# Altium project NG2092_R0M0E0.PrjPcb (part 1 of 8)
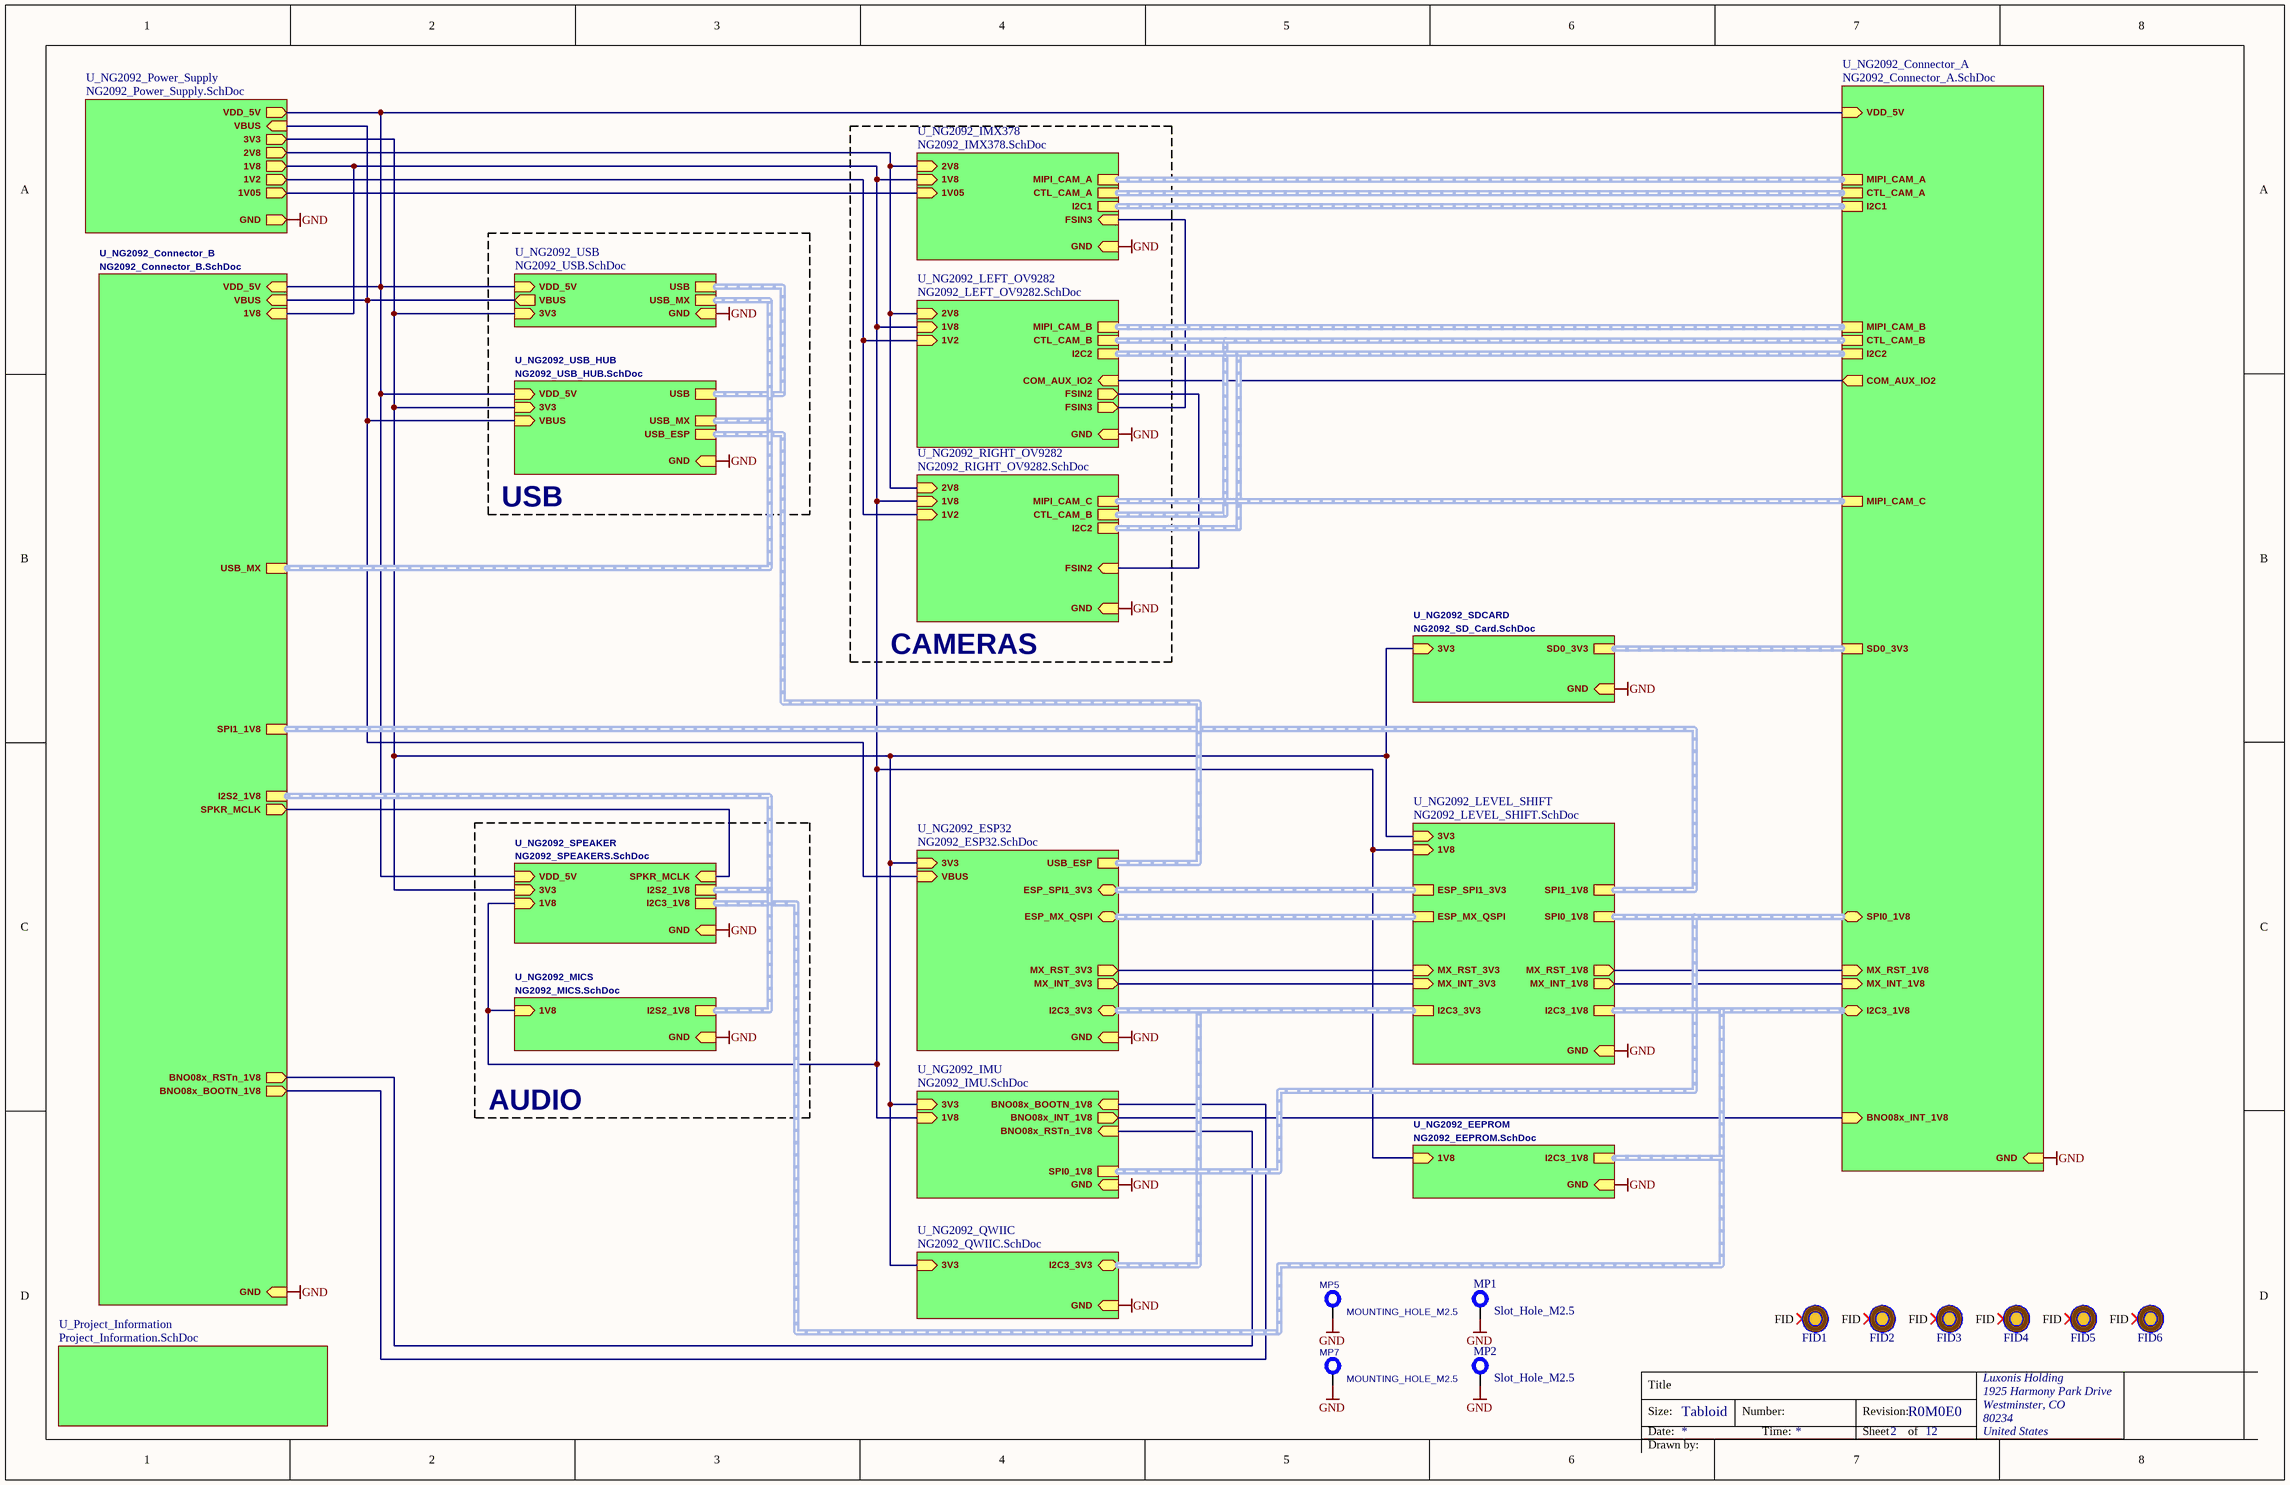
[diagram p0: NG2092_TopLevel.SchDoc]
document_number: DXXXX; drawn_by: Nejc Gostincar; project_title: NG2092; revision: R0M0E0
18 sheets, 265 parts. Net scope: strictly hierarchical (ports join the sheet entries above them; power ports are local).
Board file: NG2092.PcbDoc
Sheets:
  NG2092_TopLevel.SchDoc
    U_NG2092_Power_Supply = NG2092_Power_Supply.SchDoc
    U_NG2092_Connector_A = NG2092_Connector_A.SchDoc
    U_NG2092_IMX378 = NG2092_IMX378.SchDoc
    U_NG2092_RIGHT_OV9282 = NG2092_RIGHT_OV9282.SchDoc
    U_NG2092_LEFT_OV9282 = NG2092_LEFT_OV9282.SchDoc
    U_NG2092_USB = NG2092_USB.SchDoc
    U_Project_Information = Project_Information.SchDoc
    U_NG2092_ESP32 = NG2092_ESP32.SchDoc
    U_NG2092_IMU = NG2092_IMU.SchDoc
    U_NG2092_QWIIC = NG2092_QWIIC.SchDoc
    U_NG2092_LEVEL_SHIFT = NG2092_LEVEL_SHIFT.SchDoc
    U_NG2092_Connector_B = NG2092_Connector_B.SchDoc
    U_NG2092_MICS = NG2092_MICS.SchDoc
    U_NG2092_USB_HUB = NG2092_USB_HUB.SchDoc
    U_NG2092_SDCARD = NG2092_SD_Card.SchDoc
    U_NG2092_SPEAKER = NG2092_SPEAKERS.SchDoc
    U_NG2092_EEPROM = NG2092_EEPROM.SchDoc

## Sheet NG2092_TopLevel.SchDoc: =project_title
size Tabloid; CompanyName: Luxonis Holding; DrawnBy: Nejc Gostincar; Organization: Luxonis Holding; Address1: 1925 Harmony Park Drive; Address2: Westminster, CO; Address3: 80234; Address4: United States; DocumentNumber: DXXXX; Revision: R0M0E0; SheetNumber: 2; SheetTotal: 12

### Parts
FID1  FIDUCIAL_ROUND_1MM  [FIDUCIAL_ROUND_1MM]  (value not drawn)  (no BOM)
FID2  FIDUCIAL_ROUND_1MM  [FIDUCIAL_ROUND_1MM]  (value not drawn)  (no BOM)
FID3  FIDUCIAL_ROUND_1MM  [FIDUCIAL_ROUND_1MM]  (value not drawn)  (no BOM)
FID4  FIDUCIAL_ROUND_1MM  [FIDUCIAL_ROUND_1MM]  (value not drawn)  (no BOM)
FID5  FIDUCIAL_ROUND_1MM  [FIDUCIAL_ROUND_1MM]  (value not drawn)  (no BOM)
FID6  FIDUCIAL_ROUND_1MM  [FIDUCIAL_ROUND_1MM]  (value not drawn)  (no BOM)
MP1  Slot_Hole_M2.5  [Slot_Hole_M2.5]  (no BOM)
MP2  Slot_Hole_M2.5  [Slot_Hole_M2.5]  (no BOM)
MP5  MOUNTING_HOLE_M2.5  [MOUNTING_HOLE_M2.5]  (no BOM)
MP7  MOUNTING_HOLE_M2.5  [MOUNTING_HOLE_M2.5]  (no BOM)

### Sub-sheets
U_NG2092_Connector_A = NG2092_Connector_A.SchDoc: MIPI_CAM_B (harness MIPI_CAM_B), MIPI_CAM_A (harness MIPI_CAM_A), MIPI_CAM_C (harness MIPI_CAM_C), I2C2 (harness I2C2), I2C1 (harness I2C1), CTL_CAM_A (harness CTL_CAM_A), CTL_CAM_B (harness CTL_CAM_B), VDD_5V (in), GND (in), COM_AUX_IO2 (out), BNO08x_INT_1V8 (in), SPI0_1V8 (bidir, harness SP0_1V8), I2C3_1V8 (bidir, harness I2C3_1V8), MX_INT_1V8 (in), MX_RST_1V8 (in), SD0_3V3 (harness SD0_3V3)
U_NG2092_Connector_B = NG2092_Connector_B.SchDoc: VDD_5V (in), I2S2_1V8 (harness I2S2_1V8), GND (in), VBUS (in), SPI1_1V8 (harness SPI1_1V8), SPKR_MCLK (out), BNO08x_RSTn_1V8 (out), BNO08x_BOOTN_1V8 (out), USB_MX (harness USB_MX), 1V8 (in)
U_NG2092_EEPROM = NG2092_EEPROM.SchDoc: I2C3_1V8 (harness I2C3_1V8), 1V8 (in), GND (in)
U_NG2092_ESP32 = NG2092_ESP32.SchDoc: GND (in), 3V3 (in), MX_RST_3V3 (out), MX_INT_3V3 (out), I2C3_3V3 (bidir, harness I2C3_3V3), ESP_SPI1_3V3 (bidir, harness ESP_SPI1_3V3), ESP_MX_QSPI (bidir, harness ESP_MX_QSPI_3V3), USB_ESP (harness USB_ESP), VBUS (in)
U_NG2092_IMU = NG2092_IMU.SchDoc: BNO08x_BOOTN_1V8 (in), GND (in), 3V3 (in), BNO08x_INT_1V8 (out), BNO08x_RSTn_1V8 (in), SPI0_1V8 (harness SPI0_1V8), 1V8 (in)
U_NG2092_IMX378 = NG2092_IMX378.SchDoc: 2V8 (in), 1V05 (in), I2C1 (harness I2C1), MIPI_CAM_A (harness MIPI_CAM_A), CTL_CAM_A (harness CTL_CAM_A), GND (in), 1V8 (in), FSIN3 (in)
U_NG2092_LEFT_OV9282 = NG2092_LEFT_OV9282.SchDoc: I2C2 (harness I2C2), CTL_CAM_B (harness CTL_CAM_B), MIPI_CAM_B (harness MIPI_CAM_B), 1V2 (in), 2V8 (in), GND (in), 1V8 (in), FSIN2 (out), COM_AUX_IO2 (in), FSIN3 (out)
U_NG2092_LEVEL_SHIFT = NG2092_LEVEL_SHIFT.SchDoc: GND (in), 3V3 (in), 1V8 (in), I2C3_3V3 (harness I2C3_3V3), I2C3_1V8 (harness I2C3_1V8), MX_INT_3V3 (in), MX_INT_1V8 (out), MX_RST_1V8 (out), MX_RST_3V3 (in), SPI0_1V8 (harness SPI0_1V8), ESP_MX_QSPI (harness ESP_MX_QSPI_3V3), ESP_SPI1_3V3 (harness ESP_SPI1_3V3), SPI1_1V8 (harness SPI1_1V8)
U_NG2092_MICS = NG2092_MICS.SchDoc: I2S2_1V8 (harness I2S2_1V8), 1V8 (in), GND (in)
U_NG2092_Power_Supply = NG2092_Power_Supply.SchDoc: 1V2 (out), 2V8 (out), GND (out), 1V8 (out), VDD_5V (out), VBUS (in), 3V3 (out), 1V05 (out)
U_NG2092_QWIIC = NG2092_QWIIC.SchDoc: GND (in), 3V3 (in), I2C3_3V3 (bidir, harness I2C3_3V3)
U_NG2092_RIGHT_OV9282 = NG2092_RIGHT_OV9282.SchDoc: MIPI_CAM_C (harness MIPI_CAM_C), I2C2 (harness I2C2), 1V2 (in), 2V8 (in), GND (in), 1V8 (in), FSIN2 (in), CTL_CAM_B (harness CTL_CAM_B)
U_NG2092_SDCARD = NG2092_SD_Card.SchDoc: GND (in), 3V3 (in), SD0_3V3 (harness SD0_3V3)
U_NG2092_SPEAKER = NG2092_SPEAKERS.SchDoc: SPKR_MCLK (in), 3V3 (in), VDD_5V (in), GND (in), I2C3_1V8 (harness I2C3_1V8), I2S2_1V8 (harness I2S2_1V8), 1V8 (in)
U_NG2092_USB = NG2092_USB.SchDoc: USB (harness USB), VBUS (out), GND (in), 3V3 (in), VDD_5V (in), USB_MX (harness USB_MX)
U_NG2092_USB_HUB = NG2092_USB_HUB.SchDoc: USB_MX (harness USB_MX), USB (harness USB), USB_ESP (harness USB_ESP), VDD_5V (in), 3V3 (in), GND (in), VBUS (in)
U_Project_Information = Project_Information.SchDoc: no entries

### Nets
1V2: sheet U_NG2092_Power_Supply/1V2, sheet U_NG2092_RIGHT_OV9282/1V2, sheet U_NG2092_LEFT_OV9282/1V2
1V05: sheet U_NG2092_Power_Supply/1V05, sheet U_NG2092_IMX378/1V05
1V8: sheet U_NG2092_Power_Supply/1V8, sheet U_NG2092_IMX378/1V8, sheet U_NG2092_RIGHT_OV9282/1V8, sheet U_NG2092_LEFT_OV9282/1V8, sheet U_NG2092_IMU/1V8, sheet U_NG2092_LEVEL_SHIFT/1V8, sheet U_NG2092_Connector_B/1V8, sheet U_NG2092_MICS/1V8, sheet U_NG2092_SPEAKER/1V8, sheet U_NG2092_EEPROM/1V8
2V8: sheet U_NG2092_Power_Supply/2V8, sheet U_NG2092_IMX378/2V8, sheet U_NG2092_RIGHT_OV9282/2V8, sheet U_NG2092_LEFT_OV9282/2V8
3V3: sheet U_NG2092_Power_Supply/3V3, sheet U_NG2092_USB/3V3, sheet U_NG2092_ESP32/3V3, sheet U_NG2092_IMU/3V3, sheet U_NG2092_QWIIC/3V3, sheet U_NG2092_LEVEL_SHIFT/3V3, sheet U_NG2092_USB_HUB/3V3, sheet U_NG2092_SDCARD/3V3, sheet U_NG2092_SPEAKER/3V3
GND: MP1.1 MP2.1 MP5.1 MP7.1 ; sheet U_NG2092_Power_Supply/GND, sheet U_NG2092_Connector_A/GND, sheet U_NG2092_IMX378/GND, sheet U_NG2092_RIGHT_OV9282/GND, sheet U_NG2092_LEFT_OV9282/GND, sheet U_NG2092_USB/GND, sheet U_NG2092_ESP32/GND, sheet U_NG2092_IMU/GND, sheet U_NG2092_QWIIC/GND, sheet U_NG2092_LEVEL_SHIFT/GND, sheet U_NG2092_Connector_B/GND, sheet U_NG2092_MICS/GND, sheet U_NG2092_USB_HUB/GND, sheet U_NG2092_SDCARD/GND, sheet U_NG2092_SPEAKER/GND, sheet U_NG2092_EEPROM/GND
VBUS: sheet U_NG2092_Power_Supply/VBUS, sheet U_NG2092_USB/VBUS, sheet U_NG2092_ESP32/VBUS, sheet U_NG2092_Connector_B/VBUS, sheet U_NG2092_USB_HUB/VBUS
VDD_5V: sheet U_NG2092_Power_Supply/VDD_5V, sheet U_NG2092_Connector_A/VDD_5V, sheet U_NG2092_USB/VDD_5V, sheet U_NG2092_Connector_B/VDD_5V, sheet U_NG2092_USB_HUB/VDD_5V, sheet U_NG2092_SPEAKER/VDD_5V
BNO08x_BOOTN_1V8: sheet U_NG2092_IMU/BNO08x_BOOTN_1V8, sheet U_NG2092_Connector_B/BNO08x_BOOTN_1V8
BNO08x_INT_1V8: sheet U_NG2092_Connector_A/BNO08x_INT_1V8, sheet U_NG2092_IMU/BNO08x_INT_1V8
BNO08x_RSTn_1V8: sheet U_NG2092_IMU/BNO08x_RSTn_1V8, sheet U_NG2092_Connector_B/BNO08x_RSTn_1V8
COM_AUX_IO2: sheet U_NG2092_Connector_A/COM_AUX_IO2, sheet U_NG2092_LEFT_OV9282/COM_AUX_IO2
FSIN2: sheet U_NG2092_RIGHT_OV9282/FSIN2, sheet U_NG2092_LEFT_OV9282/FSIN2
FSIN3: sheet U_NG2092_IMX378/FSIN3, sheet U_NG2092_LEFT_OV9282/FSIN3
MX_INT_1V8: sheet U_NG2092_Connector_A/MX_INT_1V8, sheet U_NG2092_LEVEL_SHIFT/MX_INT_1V8
MX_INT_3V3: sheet U_NG2092_ESP32/MX_INT_3V3, sheet U_NG2092_LEVEL_SHIFT/MX_INT_3V3
MX_RST_1V8: sheet U_NG2092_Connector_A/MX_RST_1V8, sheet U_NG2092_LEVEL_SHIFT/MX_RST_1V8
MX_RST_3V3: sheet U_NG2092_ESP32/MX_RST_3V3, sheet U_NG2092_LEVEL_SHIFT/MX_RST_3V3
SPKR_MCLK: sheet U_NG2092_Connector_B/SPKR_MCLK, sheet U_NG2092_SPEAKER/SPKR_MCLK

Not connected (* = marked no-connect by the designer): FID1 FID*; FID2 FID*; FID3 FID*; FID4 FID*; FID5 FID*; FID6 FID*

### Buses and harness runs
harness sheet U_NG2092_Connector_A/CTL_CAM_A = sheet U_NG2092_IMX378/CTL_CAM_A
harness sheet U_NG2092_Connector_A/CTL_CAM_B = sheet U_NG2092_LEFT_OV9282/CTL_CAM_B = sheet U_NG2092_RIGHT_OV9282/CTL_CAM_B
harness sheet U_NG2092_Connector_A/I2C1 = sheet U_NG2092_IMX378/I2C1
harness sheet U_NG2092_Connector_A/I2C2 = sheet U_NG2092_LEFT_OV9282/I2C2 = sheet U_NG2092_RIGHT_OV9282/I2C2
harness sheet U_NG2092_Connector_A/I2C3_1V8 = sheet U_NG2092_EEPROM/I2C3_1V8 = sheet U_NG2092_LEVEL_SHIFT/I2C3_1V8 = sheet U_NG2092_SPEAKER/I2C3_1V8
harness sheet U_NG2092_Connector_A/MIPI_CAM_A = sheet U_NG2092_IMX378/MIPI_CAM_A
harness sheet U_NG2092_Connector_A/MIPI_CAM_B = sheet U_NG2092_LEFT_OV9282/MIPI_CAM_B
harness sheet U_NG2092_Connector_A/MIPI_CAM_C = sheet U_NG2092_RIGHT_OV9282/MIPI_CAM_C
harness sheet U_NG2092_Connector_A/SD0_3V3 = sheet U_NG2092_SDCARD/SD0_3V3
harness sheet U_NG2092_Connector_A/SPI0_1V8 = sheet U_NG2092_IMU/SPI0_1V8 = sheet U_NG2092_LEVEL_SHIFT/SPI0_1V8
harness sheet U_NG2092_Connector_B/I2S2_1V8 = sheet U_NG2092_MICS/I2S2_1V8 = sheet U_NG2092_SPEAKER/I2S2_1V8
harness sheet U_NG2092_Connector_B/SPI1_1V8 = sheet U_NG2092_LEVEL_SHIFT/SPI1_1V8
harness sheet U_NG2092_Connector_B/USB_MX = sheet U_NG2092_USB/USB_MX = sheet U_NG2092_USB_HUB/USB_MX
harness sheet U_NG2092_ESP32/ESP_MX_QSPI = sheet U_NG2092_LEVEL_SHIFT/ESP_MX_QSPI
harness sheet U_NG2092_ESP32/ESP_SPI1_3V3 = sheet U_NG2092_LEVEL_SHIFT/ESP_SPI1_3V3
harness sheet U_NG2092_ESP32/I2C3_3V3 = sheet U_NG2092_LEVEL_SHIFT/I2C3_3V3 = sheet U_NG2092_QWIIC/I2C3_3V3
harness sheet U_NG2092_ESP32/USB_ESP = sheet U_NG2092_USB_HUB/USB_ESP
harness sheet U_NG2092_USB/USB = sheet U_NG2092_USB_HUB/USB

### Notes on the sheet
- USB
- CAMERAS
- AUDIO
- Title
- Size:
- Date:
- Tabloid
- Number:
- Time:
- Revision:
- Sheet
- of
- Drawn by:

### Library data of the parts
FID1-FID6 = FIDUCIAL: Fiducial with various available footprints
MP1 MP2 = MP_Slot-Holes: =CurrentFootprint; B - Value: Not a Part; A - Level: 0
MP5 MP7 = MP_Mounting-Holes: =CurrentFootprint; B - Value: Not a Part; A - Level: 0

## Sheet NG2092_Power_Supply.SchDoc: =project_title
size Tabloid; PageSetup: Record=PageOptions|CenterHorizontal=True|CenterVertical=True|PrintScale=0.73|XCorrection=1.00|YCorrection=1.00|PrintKind=0|BorderSize=5000000|LeftOffset=0|BottomOffset=0|Orientation=2|PaperLength=1000|PaperWidth=1000|Scale=100|PaperSource=7|PrintQuality=-4|MediaType=1|DitherType=10|PaperKind=A4|PrintScaleMode=1; CompanyName: Luxonis Holding; DrawnBy: Nejc Gostincar; Organization: Luxonis Holding; Address1: 1925 Harmony Park Drive; Address2: Westminster, CO; Address3: 80234; Address4: United States; DocumentNumber: DXXXX; Revision: R0M0E0; SheetNumber: 6; SheetTotal: 12
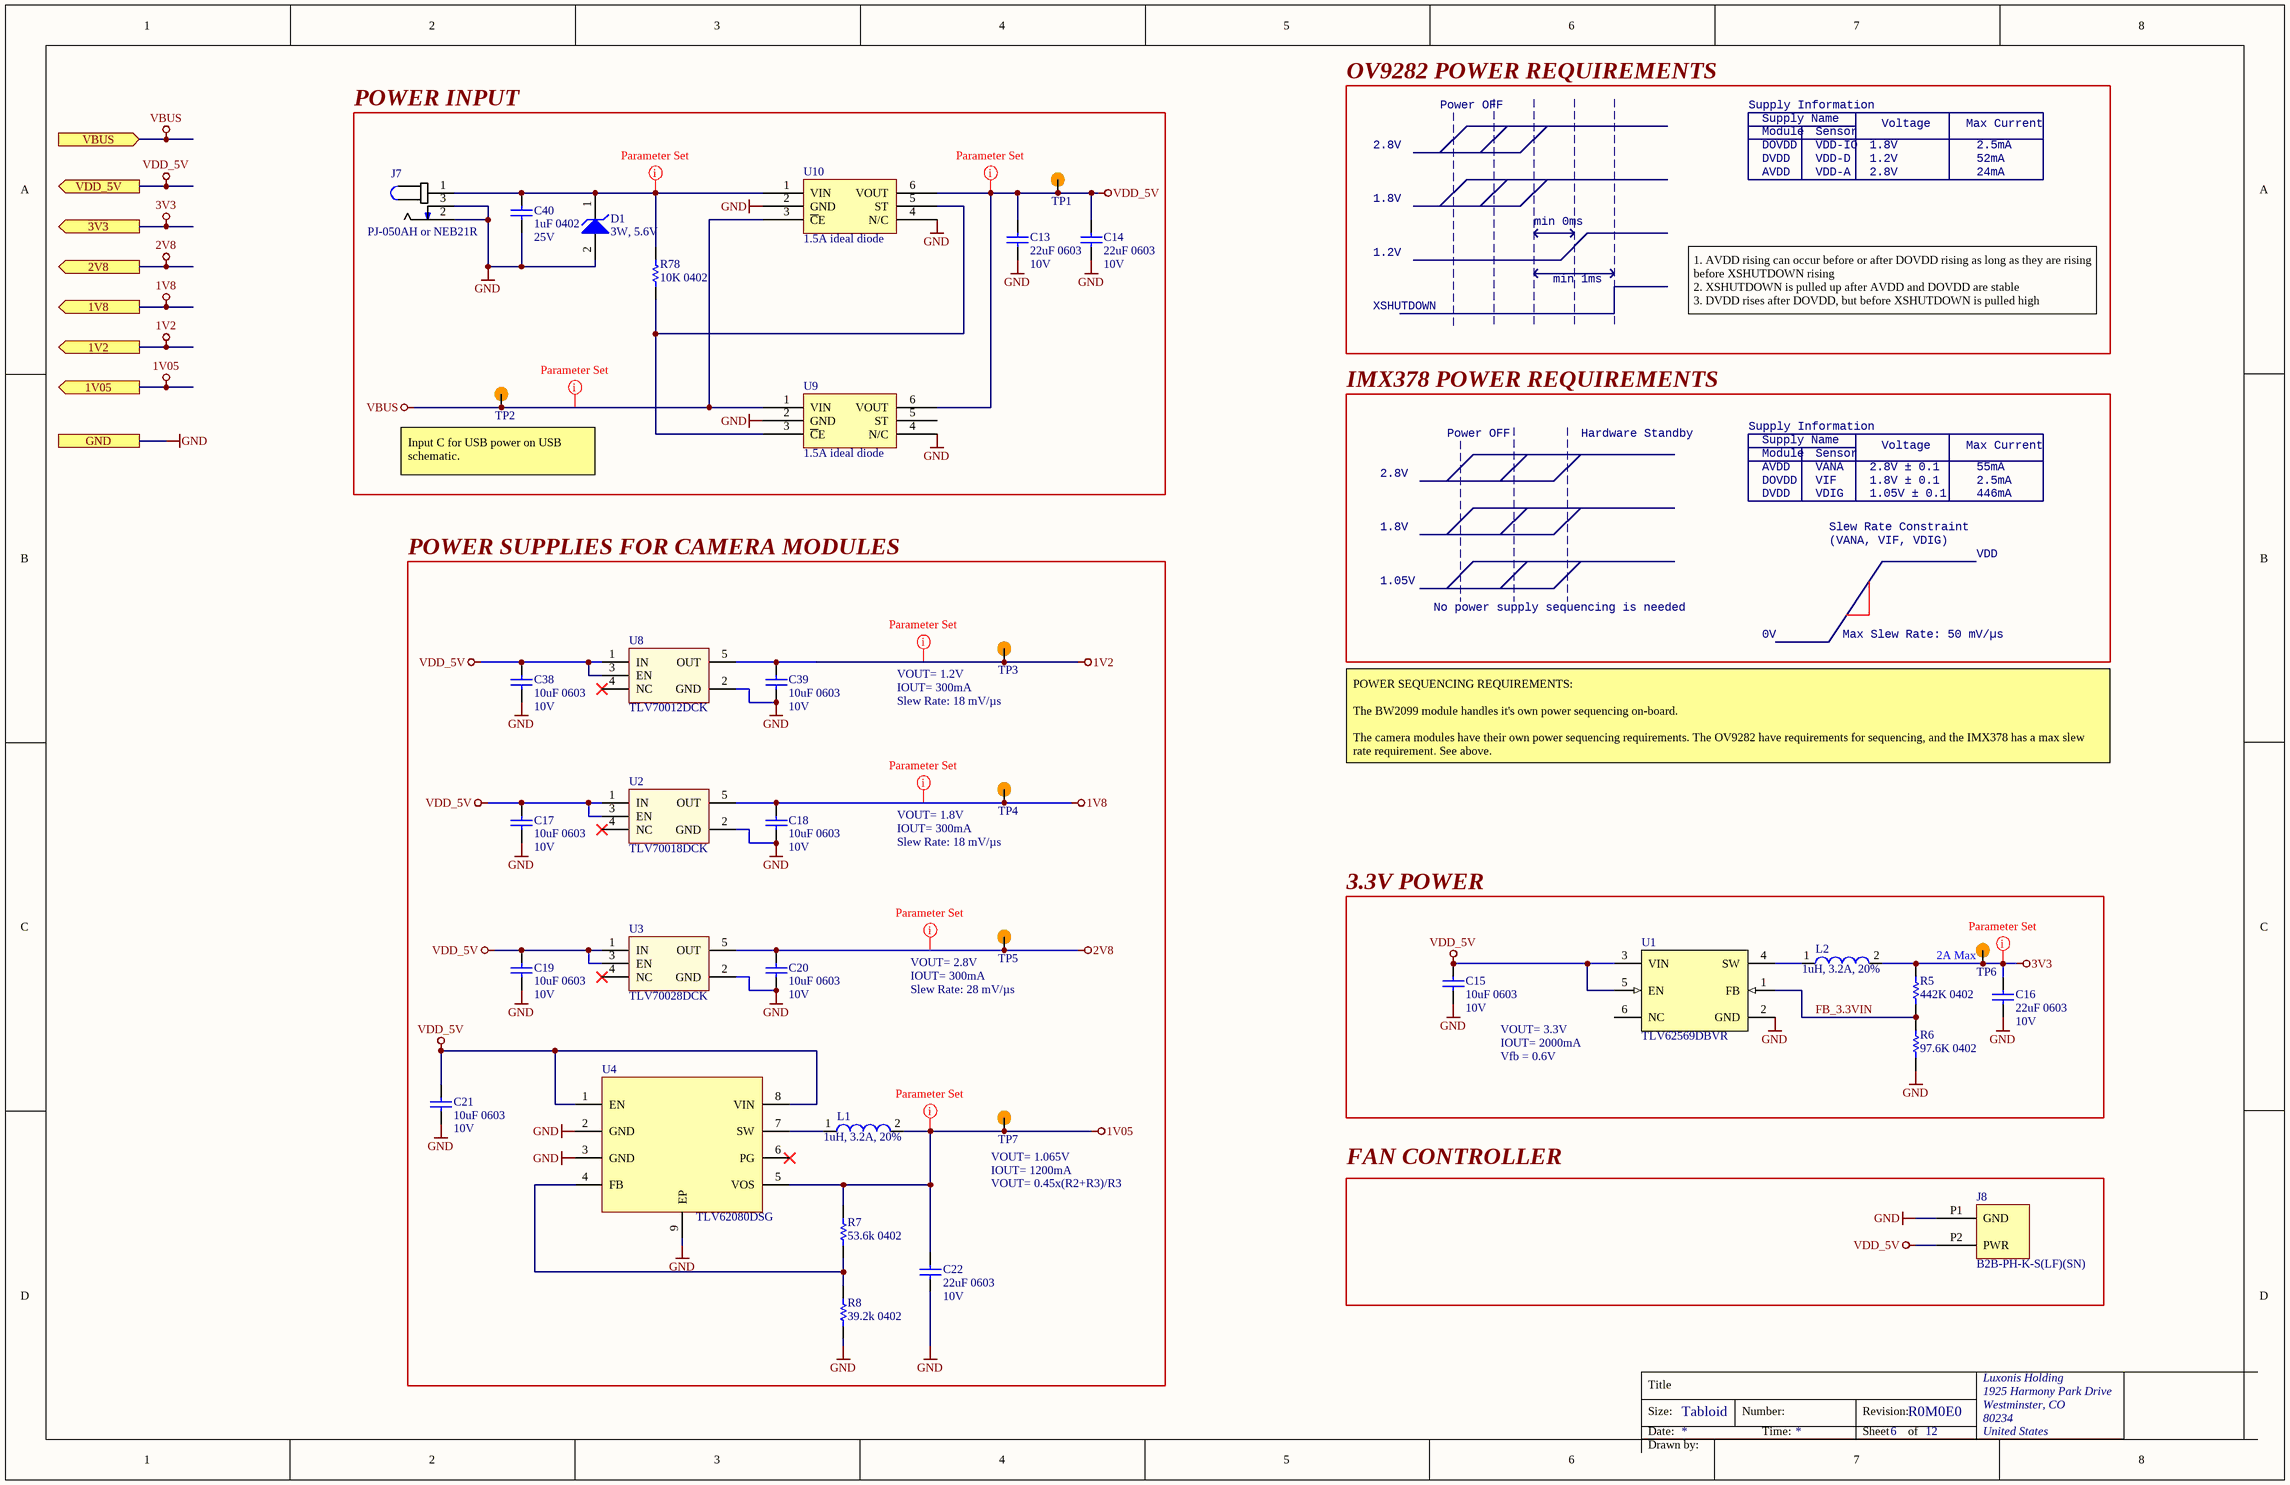
[diagram p1: NG2092_Power_Supply.SchDoc]

### Parts
C13  22uF 0603  Voltage Rating: 10V  [CAPC0603(1608)100_L]
C14  22uF 0603  Voltage Rating: 10V  [CAPC0603(1608)100_L]
C15  10uF 0603  Voltage Rating: 10V  [CAPC0603(1608)100_L]
C16  22uF 0603  Voltage Rating: 10V  [CAPC0603(1608)100_L]
C17  10uF 0603  Voltage Rating: 10V  [CAPC0603(1608)100_L]
C18  10uF 0603  Voltage Rating: 10V  [CAPC0603(1608)100_L]
C19  10uF 0603  Voltage Rating: 10V  [CAPC0603(1608)100_L]
C20  10uF 0603  Voltage Rating: 10V  [CAPC0603(1608)100_L]
C21  10uF 0603  Voltage Rating: 10V  [CAPC0603(1608)100_L]
C22  22uF 0603  Voltage Rating: 10V  [CAPC0603(1608)100_L]
C38  10uF 0603  Voltage Rating: 10V  [CAPC0603(1608)100_L]
C39  10uF 0603  Voltage Rating: 10V  [CAPC0603(1608)100_L]
C40  1uF 0402  Voltage Rating: 25V  [CAPC0402(1005)70_N]
D1  3W, 5.6V  [1SMB5919BT3G]
J7  PJ-050AH or NEB21R  [PJ-050AH/NEB21R_COMBO]
J8  B2B-PH-K-S(LF)(SN)  [B2B-PH-K-S(LF)(SN)]
L1  1uH, 3.2A, 20%  [DFE252012P-1R0M=P2]
L2  1uH, 3.2A, 20%  [DFE252012P-1R0M=P2]
R5  442K 0402  [RESC0402(1005)_N]
R6  97.6K 0402  [RESC0402(1005)_N]
R7  53.6k 0402  [RESC0402(1005)_L]
R8  39.2k 0402  [RESC0402(1005)_L]
R78  10K 0402  [RESC0402(1005)_N]
TP1  TP075_150_NS  [TP075_150_NS]  (value not drawn)  (no BOM)
TP2  TP075_150_NS  [TP075_150_NS]  (value not drawn)  (no BOM)
TP3  TP075_150_NS  [TP075_150_NS]  (value not drawn)  (no BOM)
TP4  TP075_150_NS  [TP075_150_NS]  (value not drawn)  (no BOM)
TP5  TP075_150_NS  [TP075_150_NS]  (value not drawn)  (no BOM)
TP6  TP075_150_NS  [TP075_150_NS]  (value not drawn)  (no BOM)
TP7  TP075_150_NS  [TP075_150_NS]  (value not drawn)  (no BOM)
U1  TLV62569DBVR  [SOT95P270X130-6N]
U2  TLV70018DCK  [TLV70018DCK]
U3  TLV70028DCK  [TLV70028DCK]
U4  TLV62080DSG  [TLV62080DSG]
U8  TLV70012DCK  [TLV70012DCK]
U9  1.5A ideal diode  [LM66100DCKR]
U10  1.5A ideal diode  [LM66100DCKR]

### Blocks framed on the sheet
POWER INPUT: C13 C14 C40 D1 J7 R78 TP1 TP2 U9 U10
POWER SUPPLIES FOR CAMERA MODULES: C17-C22 C38 C39 L1 R7 R8 TP3-TP5 TP7 U2-U4 U8
3.3V POWER: C15 C16 L2 R5 R6 TP6 U1
FAN CONTROLLER: J8

### Ports
1V2 (out), 1V05 (out), 1V8 (out), 2V8 (out), 3V3 (out), GND, VBUS (in), VDD_5V (out)

### Nets
1V2: C39.2 TP3.1 U8.5(OUT) ; port 1V2
1V05: C22.2 L1.2 R7.2 TP7.1 U4.5(VOS) ; port 1V05
1V8: C18.2 TP4.1 U2.5(OUT) ; port 1V8
2V8: C20.2 TP5.1 U3.5(OUT) ; port 2V8
3V3: C16.1 L2.2 R5.2 TP6.1 ; port 3V3
GND: C13.1 C14.1 C15.1 C16.2 C17.1 C18.1 C19.1 C20.1 C21.1 C22.1 C38.1 C39.1 C40.1 D1.2(A) J7.2 J7.3 J8.P1(GND) R6.1 R8.1 U1.2(GND) U2.2(GND) U3.2(GND) U4.2(GND) U4.3(GND) U4.9(EP) U8.2(GND) U9.2(GND) U9.4(N/C) U10.2(GND) U10.4(N/C) ; port GND
VBUS: TP2.1 U9.1(VIN) U10.3(~{C}E) ; port VBUS
VDD_5V: C13.2 C14.2 C15.2 C17.2 C19.2 C21.2 C38.2 J8.P2(PWR) TP1.1 U1.3(VIN) U1.5(EN) U2.1(IN) U2.3(EN) U3.1(IN) U3.3(EN) U4.1(EN) U4.8(VIN) U8.1(IN) U8.3(EN) U9.6(VOUT) U10.6(VOUT) ; port VDD_5V
FB_3.3VIN: R5.1 R6.2 U1.1(FB)
NetC40_2: C40.2 D1.1(K) J7.1 R78.2 U10.1(VIN)
NetL1_1: L1.1 U4.7(SW)
NetL2_1: L2.1 U1.4(SW)
NetR7_1: R7.1 R8.2 U4.4(FB)
NetR78_1: R78.1 U9.3(~{C}E) U10.5(ST)

Not connected (* = marked no-connect by the designer): U1 6(NC); U2 4(NC)*; U3 4(NC)*; U4 6(PG)*; U8 4(NC)*; U9 5(ST)

### Layout directives
net class POWER: 1V2, 1V05, 1V8, 2V8, 3V3, NetC40_2, VBUS, VDD_5V

### Notes on the sheet
- OV9282 POWER REQUIREMENTS
- 2.8V
- Power OFF
- Supply Information
- DOVDD
- DVDD
- Supply Name
- Module
- VDD-IO
- VDD-D
- Sensor
- 1.8V
- 1.2V
- Voltage
- Max Current
- 2.5mA
- 52mA
- min 0ms
- AVDD
- VDD-A
- 24mA
- min 1ms
- XSHUTDOWN
- 1. AVDD rising can occur before or after DOVDD rising as long as they are rising before XSHUTDOWN rising
  2. XSHUTDOWN is pulled up after AVDD and DOVDD are stable
  3. DVDD rises after DOVDD, but before XSHUTDOWN is pulled high
- IMX378 POWER REQUIREMENTS
- Hardware Standby
- (near TP2) Input C for USB power on USB schematic.
- VANA
- VIF
- VDIG
- 2.8V ± 0.1
- 1.8V ± 0.1
- 1.05V ± 0.1
- 55mA
- 446mA
- Slew Rate Constraint
- (VANA, VIF, VDIG)
- VDD
- 1.05V
- No power supply sequencing is needed
- (near TP3) VOUT= 1.2V
- (near TP3) IOUT= 300mA
- (near TP3) Slew Rate: 18 mV/µs
- 0V
- Max Slew Rate: 50 mV/µs
- POWER SEQUENCING REQUIREMENTS:
  The BW2099 module handles it's own power sequencing on-board.
  The camera modules have their own power sequencing requirements. The OV9282 have requirements for sequencing, and the IMX378 has a max slew rate requirement. See above.
- (near TP4) VOUT= 1.8V
- (near TP4) IOUT= 300mA
- (near TP4) Slew Rate: 18 mV/µs
- (near TP5) VOUT= 2.8V
- (near TP6) 2A Max
- (near TP5) IOUT= 300mA
- (near TP5) Slew Rate: 28 mV/µs
- VOUT= 3.3V
- IOUT= 2000mA
- Vfb = 0.6V
- (near TP7) VOUT= 1.065V
- (near TP7) IOUT= 1200mA
- VOUT= 0.45x(R2+R3)/R3
- Title
- Size:
- Date:
- Tabloid
- Number:
- Time:
- Revision:
- Sheet
- of
- Drawn by: